# Altium schematic sheet Power_Management_2FMC_RTM.SchDoc: RFSoC_AMC
size 420 x 297 mm; Author: T. Przywozki; CompanyName: WUT ISE; DrawnBy: T. Przywozki; Organization: WUT ISE; Address1: PW ISE; Address2: Nowowiejska 15/19 00-665 Warsaw; Revision: 1.0; SheetNumber: 30; ModifiedBy: -; CheckedDate: -; Title2: 8 channel ADC & DAC; DivGrp: WUT ISE; Designer: T. Przywozki
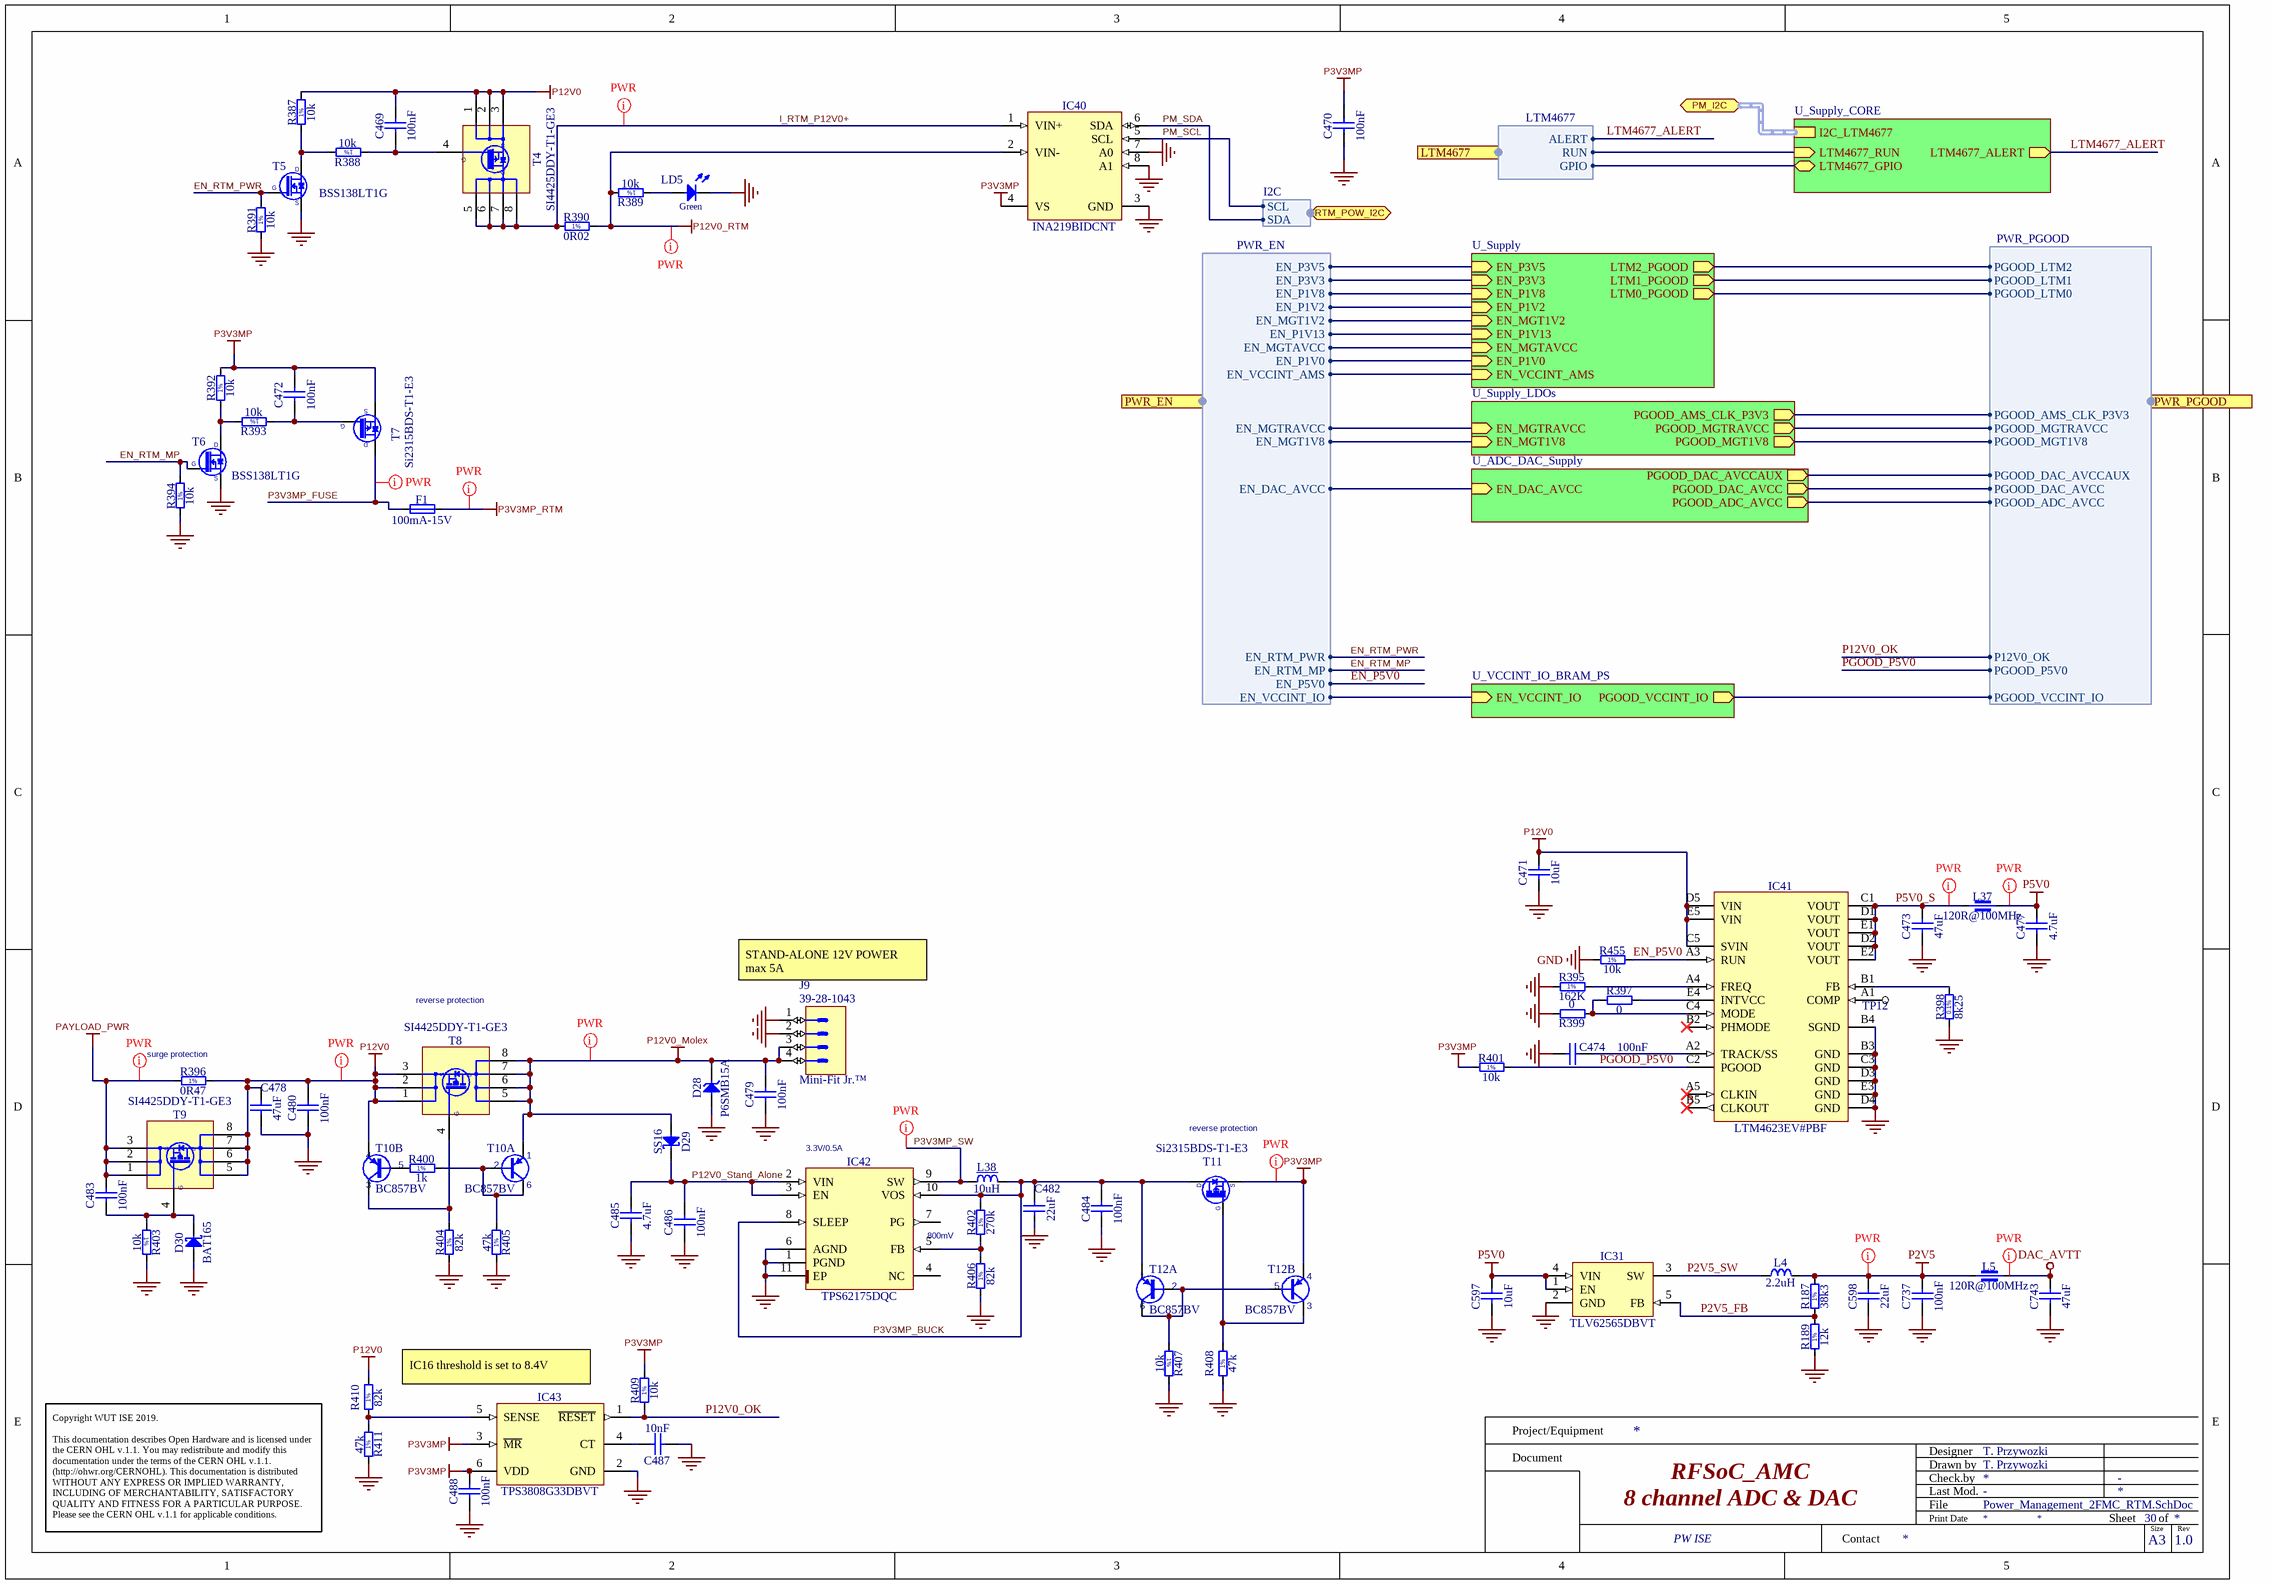
[diagram p0: Power_Management_2FMC_RTM.SchDoc]

## Parts
C469  100nF  [CAPC1005X55N]
C470  100nF  [CAPC1005X55N]
C471  10uF  [CAPC2012X95N]
C472  100nF  [CAPC1005X55N]
C473  47uF  [CAPC2012X140N]
C474  100nF  [CAPC1005X55N]
C477  4.7uF  [CAPC1709X95N]
C478  47uF  [CAPC3216X180N]
C479  100nF  [CAPC1005X55N]
C480  100nF  [CAPC1005X55N]
C482  22uF  [CAPC2012X135N]
C483  100nF  [CAPC1005X55N]
C484  100nF  [CAPC1005X55N]
C485  4.7uF  [CAPC1709X95N]
C486  100nF  [CAPC1005X55N]
C487  10nF  [CAPC1005X55N]
C488  100nF  [CAPC1005X55N]
C597  10uF  [CAPC2012X95N]
C598  22uF  [CAPC1709X100N]
C737  100nF  [CAPC0603X33N]
C743  47uF  [CAPC2012X140N]
D28  P6SMB15A  [DIOM5436X261N]
D29  SS16  [DIOM5127X229N]
D30  BAT165  [SOD2512X110N]
F1  100mA-15V  [FUSR_LITTELFUSE_0805L010]
IC31  TLV62565DBVT  [SOT95P280X145-5N]
IC40  INA219BIDCNT  [SOT65P280X145-8N]
IC41  LTM4623EV#PBF  [LGA25C127P5X5_625X625X192]
IC42  TPS62175DQC  [SON50P200X300X80-11N-R94X250]
IC43  TPS3808G33DBVT  [SOT95P280X145-6N]
J9  Mini-Fit Jr.™  Manufacturer Part Number: 39-28-1043  [MOLEX_39-28-1043]
L4  2.2uH  [IND_WURTH_WE-PMCI_0806LR]
L5  120R@100MHz  [INDC1608X95N]
L37  120R@100MHz  [INDC1608X95N]
L38  10uH  [IND_MURATA-PS_8400]
LD5  Green  [LED_KINGBRIGHT_KPH-1608CGCK]
R187  38k3  [RESC1005X40N]
R189  12k  [RESC1005X40N]
R387  10k  [RESC1005X40N]
R388  10k  [RESC1005X40N]
R389  10k  [RESC1005X40N]
R390  0R02  [RESC_VISHAY_WSL2512_0R007-0R5]
R391  10k  [RESC1005X40N]
R392  10k  [RESC1005X40N]
R393  10k  [RESC1005X40N]
R394  10k  [RESC1005X40N]
R395  162K  [RESC1608X55N]
R396  0R47  [RESC3216X65N]
R397  0  [RESC1005X40N]
R398  8k25  [RESC1608X55N]
R399  0  [RESC1005X40N]
R400  1k  [RESC1005X40N]
R401  10k  [RESC1005X40N]
R402  270k  [RESC1005X40N]
R403  10k  [RESC1005X40N]
R404  82k  [RESC1005X40N]
R405  47k  [RESC1005X40N]
R406  82k  [RESC1005X40N]
R407  10k  [RESC1005X40N]
R408  47k  [RESC1005X40N]
R409  10k  [RESC1005X40N]
R410  82k  [RESC1005X40N]
R411  47k  [RESC1005X40N]
R455  10k  [RESC1005X40N]
T4  SI4425DDY-T1-GE3  [SOIC127P600X175-8N]
T5  BSS138LT1G  [SOT95P240X110-3N]
T6  BSS138LT1G  [SOT95P240X110-3N]
T7  Si2315BDS-T1-E3  [SOT95P237X112-3N]
T8  SI4425DDY-T1-GE3  [SOIC127P600X175-8N]
T9  SI4425DDY-T1-GE3  [SOIC127P600X175-8N]
T10  BC857BV  [SOTFL50P160X60-6N]  (parts A,B of 2)
T11  Si2315BDS-T1-E3  [SOT95P237X112-3N]
T12  BC857BV  [SOTFL50P160X60-6N]  (parts A,B of 2)
TP12  TP  [TP]  (value not drawn)

## Sub-sheets
U_ADC_DAC_Supply = ADC_DAC_Supply.SchDoc: EN_DAC_AVCC (in), PGOOD_DAC_AVCC (out), PGOOD_ADC_AVCC (out), PGOOD_DAC_AVCCAUX (out)
U_Supply = Supply.SchDoc: EN_P3V3 (in), EN_P1V8 (in), EN_MGTAVCC (in), EN_P1V13 (in), EN_P1V2 (in), LTM2_PGOOD (out), EN_P1V0 (in), EN_P3V5 (in), LTM0_PGOOD (out), EN_VCCINT_AMS (in), EN_MGT1V2 (in), LTM1_PGOOD (out)
U_Supply_CORE = Supply_CORE.SchDoc: I2C_LTM4677 (harness I2C), LTM4677_GPIO (bidir), LTM4677_RUN (in), LTM4677_ALERT (out)
U_Supply_LDOs = Supply_LDOs.SchDoc: PGOOD_AMS_CLK_P3V3 (out), PGOOD_MGT1V8 (out), EN_MGT1V8 (in), EN_MGTRAVCC (in), PGOOD_MGTRAVCC (out)
U_VCCINT_IO_BRAM_PS = VCCINT_IO_BRAM_PS.SchDoc: EN_VCCINT_IO (in), PGOOD_VCCINT_IO (out)

## Ports
LTM4677 (harness LTM4677), PM_I2C (bidir, harness I2C), PWR_EN (harness PWR_EN), PWR_PGOOD (harness PWR_PGOOD), RTM_POW_I2C (bidir, harness I2C)

## Harnesses
I2C: SCL, SDA
PWR_EN: EN_MGTRAVCC, EN_MGT1V8, EN_DAC_AVCC, EN_P1V8, EN_P1V13, EN_MGT1V2, EN_P3V3, EN_P1V2, EN_P3V5, EN_MGTAVCC, EN_P1V0, EN_VCCINT_AMS, EN_RTM_PWR, EN_RTM_MP, EN_P5V0, EN_VCCINT_IO
PWR_PGOOD: PGOOD_AMS_CLK_P3V3, PGOOD_MGTRAVCC, PGOOD_MGT1V8, PGOOD_DAC_AVCCAUX, PGOOD_ADC_AVCC, PGOOD_DAC_AVCC, PGOOD_LTM0, PGOOD_LTM1, PGOOD_LTM2, P12V0_OK, PGOOD_P5V0, PGOOD_VCCINT_IO
LTM4677: GPIO, RUN, ALERT

## Nets
DAC_AVTT: C743.2 L5.2
GND: C470.1 C471.1 C473.1 C474.2 C477.1 C478.1 C479.1 C480.1 C482.1 C484.1 C485.1 C486.1 C487.1 C488.1 C597.1 C598.1 C737.1 C743.1 D28.2(A) D30.2(A) IC31.2(GND) IC40.3(GND) IC40.7(A0) IC40.8(A1) IC41.B3(GND) IC41.B4(SGND) IC41.C3(GND) IC41.D3(GND) IC41.D4(GND) IC41.E3(GND) IC42.1(PGND) IC42.6(AGND) IC42.11(EP) IC43.2(GND) J9.1 J9.2 LD5.1(C) R189.1 R391.1 R394.1 R395.1 R398.1 R399.2 R403.2 R404.1 R405.1 R406.1 R407.2 R408.1 R411.1 R455.1 T5.2(S) T6.2(S)
P2V5: C598.2 C737.2 L4.2 L5.1 R187.2
P3V3MP: C470.2 C472.2 C488.2 IC40.4(VS) IC43.3(~{MR}) IC43.6(VDD) R392.2 R401.1 R409.2 T7.2(S) T11.2(S) T12.4(E)
P3V3MP_RTM: F1.2
P5V0: C477.2 C597.2 IC31.1(EN) IC31.4(VIN) L37.2
P12V0: C469.2 C471.2 C478.2 C480.2 IC41.C5(SVIN) IC41.D5(VIN) IC41.E5(VIN) R387.2 R396.2 R410.2 T4.1(S) T4.2(S) T4.3(S) T8.1(S) T8.2(S) T8.3(S) T9.5(D) T9.6(D) T9.7(D) T9.8(D) T10.4(E)
P12V0_Molex: C479.2 D28.1(C) D29.2(A) J9.3 J9.4 T8.5(D) T8.6(D) T8.7(D) T8.8(D) T10.1(E)
P12V0_RTM: IC40.2(VIN-) R389.2 R390.2
PAYLOAD_PWR: C483.2 R396.1 T9.1(S) T9.2(S) T9.3(S)
EN_P5V0: IC41.A3(RUN) R455.2 ; port PWR_EN.EN_P5V0
EN_RTM_MP: R394.2 T6.1(G) ; port PWR_EN.EN_RTM_MP
EN_RTM_PWR: R391.2 T5.1(G) ; port PWR_EN.EN_RTM_PWR
I_RTM_P12V0+: IC40.1(VIN+) R390.1 T4.5(D) T4.6(D) T4.7(D) T4.8(D)
LTM4677_ALERT: sheet U_Supply_CORE/LTM4677_ALERT, port LTM4677.ALERT
P2V5_FB: IC31.5(FB) R187.1 R189.2
P2V5_SW: IC31.3(SW) L4.1
P3V3MP_BUCK: C482.2 C484.2 IC42.8(SLEEP) IC42.10(VOS) L38.2 R402.2 T11.3(D) T12.1(E)
P3V3MP_FUSE: F1.1 T7.3(D)
P3V3MP_SW: IC42.9(SW) L38.1
P5V0_S: C473.2 IC41.C1(VOUT) IC41.D1(VOUT) IC41.D2(VOUT) IC41.E1(VOUT) IC41.E2(VOUT) L37.1
P12V0_OK: IC43.1(~{RESET}) R409.1 ; port PWR_PGOOD.P12V0_OK
P12V0_Stand_Alone: C485.2 C486.2 D29.1(C) IC42.2(VIN) IC42.3(EN)
PGOOD_P5V0: IC41.C2(PGOOD) R401.2 ; port PWR_PGOOD.PGOOD_P5V0
PM_SCL: IC40.5(SCL) ; port RTM_POW_I2C.SCL
PM_SDA: IC40.6(SDA) ; port RTM_POW_I2C.SDA
NetC469_1: C469.1 R388.1 T4.4(S)
NetC472_1: C472.1 R393.1 T7.1(G)
NetC474_1: C474.1 IC41.A2(TRACK/SS)
NetC483_1: C483.1 D30.1(C) R403.1 T9.4(S)
NetC487_2: C487.2 IC43.4(CT)
NetIC41_A1: IC41.A1(COMP) TP12.1
NetIC41_A4: IC41.A4(FREQ) R395.2
NetIC41_B1: IC41.B1(FB) R398.2
NetIC41_C4: IC41.C4(MODE) R397.1 R399.1
NetIC41_E4: IC41.E4(INTVCC) R397.2
NetIC42_5: IC42.5(FB) R402.1 R406.2
NetIC43_5: IC43.5(SENSE) R410.1 R411.2
NetLD5_2: LD5.2(A) R389.1
NetR387_1: R387.1 R388.2 T5.3(D)
NetR392_1: R392.1 R393.2 T6.3(D)
NetR400_1: R400.1 T10.5(B)
NetR400_2: R400.2 R405.2 T10.2(B) T10.6(C)
NetR404_2: R404.2 T8.4(S) T10.3(C)
NetR407_1: R407.1 T12.2(B) T12.5(B) T12.6(C)
NetR408_2: R408.2 T11.1(G) T12.3(C)
(unnamed): sheet U_ADC_DAC_Supply/EN_DAC_AVCC, port PWR_EN.EN_DAC_AVCC
(unnamed): sheet U_ADC_DAC_Supply/PGOOD_DAC_AVCC, port PWR_PGOOD.PGOOD_DAC_AVCC
(unnamed): sheet U_ADC_DAC_Supply/PGOOD_ADC_AVCC, port PWR_PGOOD.PGOOD_ADC_AVCC
(unnamed): sheet U_ADC_DAC_Supply/PGOOD_DAC_AVCCAUX, port PWR_PGOOD.PGOOD_DAC_AVCCAUX
(unnamed): sheet U_Supply_CORE/LTM4677_GPIO, port LTM4677.GPIO
(unnamed): sheet U_Supply_CORE/LTM4677_RUN, port LTM4677.RUN
(unnamed): sheet U_Supply_LDOs/PGOOD_AMS_CLK_P3V3, port PWR_PGOOD.PGOOD_AMS_CLK_P3V3
(unnamed): sheet U_Supply_LDOs/PGOOD_MGT1V8, port PWR_PGOOD.PGOOD_MGT1V8
(unnamed): sheet U_Supply_LDOs/EN_MGT1V8, port PWR_EN.EN_MGT1V8
(unnamed): sheet U_Supply_LDOs/EN_MGTRAVCC, port PWR_EN.EN_MGTRAVCC
(unnamed): sheet U_Supply_LDOs/PGOOD_MGTRAVCC, port PWR_PGOOD.PGOOD_MGTRAVCC
(unnamed): sheet U_Supply/EN_P3V3, port PWR_EN.EN_P3V3
(unnamed): sheet U_Supply/EN_P1V8, port PWR_EN.EN_P1V8
(unnamed): sheet U_Supply/EN_MGTAVCC, port PWR_EN.EN_MGTAVCC
(unnamed): sheet U_Supply/EN_P1V13, port PWR_EN.EN_P1V13
(unnamed): sheet U_Supply/EN_P1V2, port PWR_EN.EN_P1V2
(unnamed): sheet U_Supply/LTM2_PGOOD, port PWR_PGOOD.PGOOD_LTM2
(unnamed): sheet U_Supply/EN_P1V0, port PWR_EN.EN_P1V0
(unnamed): sheet U_Supply/EN_P3V5, port PWR_EN.EN_P3V5
(unnamed): sheet U_Supply/LTM0_PGOOD, port PWR_PGOOD.PGOOD_LTM0
(unnamed): sheet U_Supply/EN_VCCINT_AMS, port PWR_EN.EN_VCCINT_AMS
(unnamed): sheet U_Supply/EN_MGT1V2, port PWR_EN.EN_MGT1V2
(unnamed): sheet U_Supply/LTM1_PGOOD, port PWR_PGOOD.PGOOD_LTM1
(unnamed): sheet U_VCCINT_IO_BRAM_PS/EN_VCCINT_IO, port PWR_EN.EN_VCCINT_IO
(unnamed): sheet U_VCCINT_IO_BRAM_PS/PGOOD_VCCINT_IO, port PWR_PGOOD.PGOOD_VCCINT_IO

Not connected (* = marked no-connect by the designer): IC41 A5(CLKIN)* B2(PHMODE)* B5(CLKOUT)*; IC42 4(NC) 7(PG)

## Buses and harness runs
harness port PM_I2C = sheet U_Supply_CORE/I2C_LTM4677

## Layout directives
net class PWR: DAC_AVTT, I_RTM_P12V0+, P2V5, P3V3MP, P3V3MP_FUSE, P3V3MP_RTM, P3V3MP_SW, P5V0, P5V0_S, P12V0, P12V0_Molex, P12V0_RTM, PAYLOAD_PWR

## Notes on the sheet
- (near J9) STAND-ALONE 12V POWER
  max 5A
- (near R396) surge protection
- reverse protection
- (near T11) reverse protection
- (near IC42) 3.3V/0.5A
- (near IC42) 800mV
- IC16 threshold is set to 8.4V
- Project/Equipment
- Document
- Designer
- Drawn by
- Check.by
- Copyright WUT ISE 2019.
  This documentation describes Open Hardware and is licensed under the CERN OHL v.1.1. You may redistribute and modify this documentation under the terms of the CERN OHL v.1.1. (http://ohwr.org/CERNOHL). This documentation is distributed WITHOUT ANY EXPRESS OR IMPLIED WARRANTY, INCLUDING OF MERCHANTABILITY, SATISFACTORY QUALITY AND FITNESS FOR A PARTICULAR PURPOSE. Please see the CERN OHL v.1.1 for applicable conditions.
- Contact
- File
- Last Mod.
- Print Date
- Sheet
- Size
- A3
- of
- Rev
- (in symbol R0402_1K_1%_0.0625W_100PPM) 1%
- (in symbol R0402_10K_1%_0.0625W_100PPM) 1%
- (in symbol R0402_12K_1%_0.0625W_100PPM) 1%
- (in symbol R0402_38K3_1%_0.0625W_100PPM) 1%
- (in symbol R0402_47K_1%_0.0625W_100PPM) 1%
- (in symbol R0402_82K_1%_0.0625W_100PPM) 1%
- (in symbol R0402_270K_1%_0.0625W_100PPM) 1%
- (in symbol R0603_8K25_0.1%_0.063W_10PPM) 0.1%
- (in symbol R0603_162K_1%_0.1W_100PPM) 1%
- (in symbol R1206_0R47_1%_0.5W_600PPM) 1%
- (in symbol R2512_0R02_1%_1W_75PPM_VISHAY_WSL) 1%
- (in symbol SI4425DDY-T1-GE3) G

## Library data of the parts
C469 C470 C472 C479 C480 C483 C484 C486 C488 = CC0402_100NF_16V_10%_X5R: Non-polarised capacitor; Manufacturer: GENERIC; Part Description: SMD Multilayer Chip Ceramic Capacitor; Manufacturer1 Part Number: GRM155R61C104KA88D; Tolerance: ±10%; Voltage: 16V; TC: X5R; Manufacturer Part Number: CC0402_100NF_16V_10%_X5R; Part Number: CC0402_100NF_16V_10%_X5R; Value: 100nF; Component Kind: Standard; Component Type: Standard; Pin Count: 2; Status: None; Case: 0402; Mounted: Yes; Socket: No; SMD: Yes; Sense: No; Manufacturer1 Example: MURATA; Manufacturer1 ComponentHeight: 0.55mm; HelpURL: \\cern.ch\dfs\Applications\Altium\Datasheets\CC0402_X5R_MURATA_GRM.pdf; Author: CERN DEM JLC; CreateDate: 10.12.2013; LatestRevisionDate: 10.12.2013
C471 C597 = CC0805_10UF_25V_10%_X5R: Non-polarised capacitor; Part Description: SMD Multilayer Chip Ceramic Capacitor; Manufacturer: GENERIC; Manufacturer1 Part Number: GRM219R61E106KA12D; Voltage: 25V; TC: X5R; Tolerance: ±10%; Part Number: CC0805_10UF_25V_10%_X5R; Component Kind: Standard; Component Type: Standard; Pin Count: 2; Value: 10uF; Status: Preferred; Manufacturer Part Number: CC0805_10UF_25V_10%_X5R; Case: 0805; Mounted: Yes; Socket: No; SMD: Yes; Sense: No; Manufacturer1 Example: MURATA; Manufacturer1 ComponentHeight: 0.95mm; HelpURL: \\cern.ch\dfs\Applications\Altium\Datasheets\CC0805_X5R_MURATA_GRM.pdf; Author: CERN DEM JLC; CreateDate: 25.10.2012; LatestRevisionDate: 06.09.2016
C473 C743 = CC0805_47UF_6.3V_20%_X5R: Non-polarised capacitor; Manufacturer: GENERIC; Part Description: SMD Multilayer Chip Ceramic Capacitor; Manufacturer1 Part Number: C0805C476M9PACTU; Tolerance: ±20%; Voltage: 6.3V; TC: X5R; Manufacturer Part Number: CC0805_47UF_6.3V_20%_X5R; Part Number: CC0805_47UF_6.3V_20%_X5R; Value: 47uF; Component Kind: Standard; Component Type: Standard; Pin Count: 2; Status: Preferred; Case: 0805; Mounted: Yes; Socket: No; SMD: Yes; Sense: No; Manufacturer1 Example: KEMET; Manufacturer1 ComponentHeight: 1.4mm; HelpURL: \\cern.ch\dfs\Applications\Altium\Datasheets\CC0805_X5R_KEMET.pdf; Author: CERN DEM JLC; CreateDate: 16.10.2012; LatestRevisionDate: 16.10.2012
C474 = CC0402_100NF_16V_10%_X5R: Non-polarised capacitor; Part Description: SMD Multilayer Chip Ceramic Capacitor; Manufacturer: GENERIC; Manufacturer1 Part Number: GRM155R61C104KA88D; Voltage: 16V; TC: X5R; Tolerance: ±10%; Part Number: CC0402_100NF_16V_10%_X5R; Component Kind: Standard; Component Type: Standard; Pin Count: 2; Value: 100nF; Status: None; Manufacturer Part Number: CC0402_100NF_16V_10%_X5R; Case: 0402; Mounted: Yes; Socket: No; SMD: Yes; Sense: No; Manufacturer1 Example: MURATA; Manufacturer1 ComponentHeight: 0.55mm; HelpURL: \\cern.ch\dfs\Applications\Altium\Datasheets\CC0402_X5R_MURATA_GRM.pdf; Author: CERN DEM JLC; CreateDate: 10.12.2013; LatestRevisionDate: 10.12.2013
C477 C485 = CC0603_4.7UF_16V_10%_X5R: Non-polarised capacitor; Manufacturer: GENERIC; Part Description: SMD Multilayer Chip Ceramic Capacitor; Manufacturer1 Part Number: EMK107ABJ475KA-T; Tolerance: ±10%; Voltage: 16V; TC: X5R; Manufacturer Part Number: CC0603_4.7UF_16V_10%_X5R; Part Number: CC0603_4.7UF_16V_10%_X5R; Value: 4.7uF; Component Kind: Standard; Component Type: Standard; Pin Count: 2; Status: None; Case: 0603; Mounted: Yes; Socket: No; SMD: Yes; Sense: No; Manufacturer1 Example: TAIYO YUDEN; Manufacturer1 ComponentHeight: 0.95mm; HelpURL: \\cern.ch\dfs\Applications\Altium\Datasheets\CC0603_X7R_TAIYO-YUDEN_HIGH-VALUE.pdf; Author: CERN DEM JLC; CreateDate: 16.12.2013; LatestRevisionDate: 16.09.2014
C478 = CC1206_47UF_25V_20%_X5R: Non-polarised capacitor; Manufacturer: GENERIC; Part Description: SMD Multilayer Chip Ceramic Capacitor; Manufacturer1 Part Number: C3216X5R1E476M160AC; Tolerance: ±20%; Voltage: 25V; TC: X5R; Manufacturer Part Number: CC1206_47UF_25V_20%_X5R; Part Number: CC1206_47UF_25V_20%_X5R; Value: 47uF; Component Kind: Standard; Component Type: Standard; Pin Count: 2; Status: None; Case: 1206; Mounted: Yes; Socket: No; SMD: Yes; Sense: No; Manufacturer1 Example: TDK; Manufacturer1 ComponentHeight: 1.8mm; HelpURL: \\cern.ch\dfs\Applications\Altium\Datasheets\CC1206_X5R_TDK_C.pdf; Author: CERN DEM JLC; CreateDate: 20.11.2013; LatestRevisionDate: 14.03.2017
C482 = CC0805_22UF_16V_10%_X5R: Non-polarised capacitor; Manufacturer: GENERIC; Part Description: SMD Multilayer Chip Ceramic Capacitor; Manufacturer1 Part Number: C2012X5R1C226KT; Tolerance: ±10%; Voltage: 16V; TC: X5R; Manufacturer Part Number: CC0805_22UF_16V_10%_X5R; Part Number: CC0805_22UF_16V_10%_X5R; Value: 22uF; Component Kind: Standard; Component Type: Standard; Pin Count: 2; Status: Preferred; Case: 0805; Mounted: Yes; Socket: No; SMD: Yes; Sense: No; Manufacturer1 Example: TDK; Manufacturer1 ComponentHeight: 1.35mm; HelpURL: \\cern.ch\dfs\Applications\Altium\Datasheets\CC0805_X5R_TDK_C.pdf; Author: CERN DEM JLC; CreateDate: 25.10.2012; LatestRevisionDate: 25.10.2012
C487 = CC0402_10NF_16V_10%_X7R: Non-polarised capacitor; Manufacturer: GENERIC; Part Description: SMD Multilayer Chip Ceramic Capacitor; Manufacturer1 Part Number: 223878715636; Tolerance: ±10%; Voltage: 16V; TC: X7R; Manufacturer Part Number: CC0402_10NF_16V_10%_X7R; Part Number: CC0402_10NF_16V_10%_X7R; Value: 10nF; Component Kind: Standard; Component Type: Standard; Pin Count: 2; Status: Not Recommended; Case: 0402; Mounted: Yes; Socket: No; SMD: Yes; Sense: No; Manufacturer1 Example: PHYCOMP; Manufacturer1 ComponentHeight: 0.55mm; HelpURL: \\cern.ch\dfs\Applications\Altium\Datasheets\CC0402_X7R_PHYCOMP.pdf; Author: CERN DEM JLC; CreateDate: 03.12.2007; LatestRevisionDate: 03.12.2007
C598 = CC0603_22UF_6.3V_20%_X5R: Non-polarised capacitor; Part Description: SMD Multilayer Chip Ceramic Capacitor; Manufacturer: GENERIC; Manufacturer1 Part Number: C1608X5R0J226M080AC; Voltage: 6.3V; TC: X5R; Tolerance: ±20%; Part Number: CC0603_22UF_6.3V_20%_X5R; Component Kind: Standard; Component Type: Standard; Pin Count: 2; Value: 22uF; Status: None; Manufacturer Part Number: CC0603_22UF_6.3V_20%_X5R; Case: 0603; Mounted: Yes; Socket: No; SMD: Yes; Sense: No; Manufacturer1 Example: TDK; Manufacturer1 ComponentHeight: 1mm; HelpURL: \\cern.ch\dfs\Applications\Altium\Datasheets\CC0603_X5R_TDK_C.pdf; Author: CERN DEM JLC; CreateDate: 16.12.2013; LatestRevisionDate: 13.09.2016
C737 = CC0201_100NF_6.3V_10%_X5R: Non-polarised capacitor; Part Description: SMD Multilayer Chip Ceramic Capacitor; Manufacturer: GENERIC; Manufacturer1 Part Number: 02016D104KAT2A; Voltage: 6.3V; TC: X5R; Tolerance: ±10%; Part Number: CC0201_100NF_6.3V_10%_X5R; Component Kind: Standard; Component Type: Standard; Pin Count: 2; Value: 100nF; Status: Not Recommended; Manufacturer Part Number: CC0201_100NF_6.3V_10%_X5R; Case: 0201; Mounted: Yes; Socket: No; SMD: Yes; Sense: No; Manufacturer1 Example: AVX; Manufacturer1 ComponentHeight: 0.33mm; HelpURL: \\cern.ch\dfs\Applications\Altium\Datasheets\CC0201_X5R_AVX.pdf; Author: CERN DEM JLC; CreateDate: 03.12.2007; LatestRevisionDate: 03.12.2007
D28 = P6SMB15A: Transient Voltage Suppressor Diode (Uni-Directional); Manufacturer: LITTELFUSE; Part Description: Uni-directional Transient Voltage Suppressor (TVS) Diode; Voltage: 15V; Power: 600W; PressFit: No; Bonding: No; Manufacturer Part Number: P6SMB15A; PackageDescription: DO-214-AA/SMB Diode, Molded Body; 5.40mm L X 3.62mm W X 2.61mm H, IPC Medium Density; Part Number: P6SMB15A; Component Kind: Standard; Component Type: Standard; Device: P6SMB15A; Pin Count: 2; Case: SMB; Mounted: Yes; Socket: No; SMD: Yes; Sense: No; ComponentHeight: 2.61mm; HelpURL: \\cern.ch\dfs\Applications\Altium\Datasheets\P6SMB15A.pdf; Author: CERN DEM JLC; CreateDate: 12.07.2017; LatestRevisionDate: 12.07.2017
D29 = SS16: Schottky Diode; Manufacturer: VISHAY GENERAL SEMICONDUCTOR; Part Description: Surface Mount Schottky Barrier Rectifier; Voltage: 60V; Power: 1A; PressFit: No; Bonding: No; Manufacturer Part Number: SS16; PackageDescription: DO-214-AC Molded Diode, Body 5.1x2.7mm, IPC Medium Density; Part Number: SS16; Component Kind: Standard; Component Type: Standard; Device: SS16; Pin Count: 2; Case: DO-214AC; Mounted: Yes; Socket: No; SMD: Yes; Sense: No; ComponentHeight: 2.29mm; HelpURL: \\cern.ch\dfs\Applications\Altium\Datasheets\SS16.pdf; Author: CERN DEM JLC; CreateDate: 15.07.2008; LatestRevisionDate: 23.08.2010
D30 = BAT165: Schottky Diode; Manufacturer: INFINEON; Part Description: Medium Power AF Schottky Diode; Voltage: 40V; Power: 750mA; PressFit: No; Bonding: No; Manufacturer Part Number: BAT165; PackageDescription: Small Outline Diode (SOD-323), 1.70mm W X 1.25mm L X 1.10mm H body,  IPC Medium Density; Part Number: BAT165; Component Kind: Standard; Component Type: Standard; Device: BAT165; Pin Count: 2; Case: SOD323; Mounted: Yes; Socket: No; SMD: Yes; Sense: No; ComponentHeight: 1.1mm; HelpURL: \\cern.ch\dfs\Applications\Altium\Datasheets\BAT165.pdf; Author: CERN DEM JLC; CreateDate: 12.11.2014; LatestRevisionDate: 12.11.2014
F1 = FUSR_LITTELFUSE_0805L010YR: Fuse; Part Description: POLYFUSE® Surface Mount Resettable PTC; PressFit: No; Manufacturer Part Number: 0805L010YR; Manufacturer: LITTELFUSE; PackageDescription: Surface Mount POLY-FUSE® Resettable PTC, 0805L Series; Part Number: FUSR_LITTELFUSE_0805L010YR; Value: 100mA-15V; Component Kind: Standard; Component Type: Standard; Pin Count: 2; Family: Fuses Resettable; Mounted: Yes; Socket: No; SMD: Yes; Sense: No; ComponentHeight: 1mm; HelpURL: \\cern.ch\dfs\Applications\Altium\Datasheets\FUSR_LITTELFUSE_0805L010YR.pdf; Author: CERN DEM JLC; CreateDate: 11.09.2012; LatestRevisionDate: 11.09.2012
IC31 = TLV62565DBVT: 1.5A High Efficiency Step-Down Converter, Adjustable Output Voltage; Manufacturer: TEXAS INSTRUMENTS; PressFit: No; Bonding: No; Part Number: TLV62565DBVT; Component Kind: Standard; Component Type: Standard; Device: TLV62565DBVT; PackageDescription: SOT, 0.95mm Pitch; 5 Pin, 1.60mm W X 2.90mm L X 1.45mm H Body, IPC Medium Density; Part Description: 1.5A High Efficiency Step-Down Converter, Adjustable Output Voltage; Manufacturer Part Number: TLV62565DBVT; Pin Count: 5; Case: SOT23-5; Mounted: Yes; Socket: No; SMD: Yes; Sense: No; ComponentHeight: 1.45mm; HelpURL: \\cern.ch\dfs\Applications\Altium\Datasheets\TLV62565DBVT.pdf; Author: CERN DEM JMW; CreateDate: 29.08.2016; LatestRevisionDate: 29.08.2016
IC40 = INA219BIDCNT: Zero-Drift, Bi-Directional CURRENT/POWER MONITOR with I2C™ Interface; Manufacturer: TEXAS INSTRUMENTS; PressFit: No; Bonding: No; Manufacturer Part Number: INA219BIDCNT; PackageDescription: SOT, 0.65mm pitch; 8 pin, 1.625mm W X 2.90mm L X 1.45mm H body, IPC Medium Density; Part Description: Zero-Drift, Bi-Directional CURRENT/POWER MONITOR with I2C™ Interface; Part Number: INA219BIDCNT; Component Kind: Standard; Component Type: Standard; Device: INA219BIDCNT; Pin Count: 8; Case: SOT23-8; Mounted: Yes; Socket: No; SMD: Yes; Sense: No; ComponentHeight: 1.45mm; Author: CERN DEM JLC; HelpURL: \\cern.ch\dfs\Applications\Altium\Datasheets\INA219BIDCNT.pdf; CreateDate: 24.09.2013; LatestRevisionDate: 24.09.2013
IC41 = LTM4623EV#PBF: 4V-20V to 0.6V-5.5V, Iout 3A Step-Down DC/DC uModule Regulator; Manufacturer: LINEAR TECHNOLOGY; PressFit: No; Bonding: No; Part Number: LTM4623EV#PBF; Component Kind: Standard; Component Type: Standard; Device: LTM4623EV#PBF; PackageDescription: LGA, 1.27mm Pitch, Square; 25 Pin, 5 Columns X 5 Rows, 6.25mm X 6.25mm X 1.92mm H; Part Description: 4V-20V to 0.6V-5.5V, Iout 3A Step-Down DC/DC uModule Regulator; Manufacturer Part Number: LTM4623EV#PBF; Pin Count: 25; Case: LGA25; Mounted: Yes; Socket: No; SMD: Yes; Sense: No; ComponentHeight: 1.92mm; HelpURL: \\cern.ch\dfs\Applications\Altium\Datasheets\LTM4623EV#PBF.pdf; Author: CERN DEM JMW; CreateDate: 23.09.2015; LatestRevisionDate: 23.09.2015
IC42 = TPS62175DQC: 4.75-28VDC to 1-6VDC, 500mA Step-Down Converter With Sleep Mode; Manufacturer: TEXAS INSTRUMENTS; PressFit: No; Bonding: No; Manufacturer Part Number: TPS62175DQC; PackageDescription: SON, 10-Leads, Body 2x3mm, Pitch 0.5mm, Thermal Pad 0.94x2.5mm, IPC Medium Density; Part Description: 4.75-28VDC to 1-6VDC, 500mA Step-Down Converter With Sleep Mode; Part Number: TPS62175DQC; Component Kind: Standard; Component Type: Standard; Device: TPS62175DQC; Pin Count: 11; Case: SON10; Mounted: Yes; Socket: No; SMD: Yes; Sense: No; ComponentHeight: 0.8mm; HelpURL: \\cern.ch\dfs\Applications\Altium\Datasheets\TPS62175DQC.pdf; Author: CERN DEM JMW; CreateDate: 11.08.2015; LatestRevisionDate: 11.08.2015
IC43 = TPS3808G33DBVT: Low Quiescent Current, Programmable-Delay Supervisory Circuit; Manufacturer: TEXAS INSTRUMENTS; Part Description: 3.3V, Low Quiescent Current, Programmable-Delay Supervisory Circuit; PressFit: No; Bonding: No; Manufacturer Part Number: TPS3808G33DBVT; PackageDescription: SOT23, 6-Leads, Body 1.6x3.0mm, Pitch 0.95mm, IPC Medium Density; Part Number: TPS3808G33DBVT; Component Kind: Standard; Component Type: Standard; Device: TPS3808G33DBVT; Pin Count: 6; Case: SOT23-6; Mounted: Yes; Socket: No; SMD: Yes; Sense: No; ComponentHeight: 1.45mm; Author: CERN DEM JLC; HelpURL: \\cern.ch\dfs\Applications\Altium\Datasheets\TPS3808G33DBVT.pdf; CreateDate: 05.11.2013; LatestRevisionDate: 05.11.2013
J9 = MOLEX_39-28-1043: Connector 4 Male; Manufacturer: MOLEX; Part Description: 4.20mm (.165") Pitch Mini-Fit Jr.™ Header, Dual Row, Vertical, without Snap-in Plastic Peg PCB Lock, 4 Circuits; PressFit: No; Part Number: MOLEX_39-28-1043; Component Kind: Standard; Component Type: Standard; Pin Count: 4; Family: Mini-Fit Jr.™; Mounted: Yes; Socket: No; SMD: No; Sense: No; Status: None; ComponentHeight: 13.1mm; HelpURL: \\cern.ch\dfs\Applications\Altium\Datasheets\MOLEX_39-28-1043.pdf; Author: CERN DEM JLC; CreateDate: 12.03.2009; LatestRevisionDate: 06.03.2012
L4 = IND_2.2UH_20%_WURTH_WE-PMCI_74479276222C: Inductor; Part Description: SMD Power Molded Chip  Inductor (WE-PMCI Series); Manufacturer: WURTH ELEKTRONIK; Power: 1.1A; Resistance: 0.112R; Tolerance: ±20%; Part Number: IND_2.2UH_20%_WURTH_WE-PMCI_74479276222C; Component Kind: Standard; Component Type: Standard; Pin Count: 2; Value: 2.2uH; Status: None; Manufacturer Part Number: 74479276222C; Case: 0806; Mounted: Yes; Socket: No; SMD: Yes; Sense: No; ComponentHeight: 1mm; HelpURL: \\cern.ch\dfs\Applications\Altium\Datasheets\IND_WURTH_WE-PMCI_74479276222C.pdf; Author: CERN DEM JLC; CreateDate: 20.10.2016; LatestRevisionDate: 20.10.2016
L5 L37 = IND0603_MURATA_BLM18PG121SN1D: Manufacturer: MURATA; Part Description: SMD EMIFIL Chip Ferrite Bead; Power: 2A; Resistance: 0.05R; Case: 0603; ComponentHeight: 0.95mm; Manufacturer Part Number: BLM18PG121SN1D; Part Number: IND0603_MURATA_BLM18PG121SN1D; Pin Count: 2; SMD: Yes; Value: 120R@100MHz; Component Kind: Standard; Component Type: Standard; Status: None; Mounted: Yes; Socket: No; Sense: No; HelpURL: \\cern.ch\dfs\Applications\Altium\Datasheets\IND0603_MURATA_BLM18P.pdf; Author: CERN DEM BC; CreateDate: 27.07.2015; LatestRevisionDate: 25.10.2018
L38 = IND_10UH_10%_MURATA-PS_8400: Inductor With Core; Manufacturer Part Number: 84103C; Manufacturer: MURATA POWER SOLUTIONS; Part Description: Miniature Surface Mount Power Inductor (8400 Series); Tolerance: ±10%; Power: 950mA; Resistance: 0.24R; Part Number: IND_10UH_10%_MURATA-PS_8400; Value: 10uH; Component Kind: Standard; Component Type: Standard; Pin Count: 2; Status: None; Mounted: Yes; Socket: No; SMD: Yes; Sense: No; ComponentHeight: 2.9mm; HelpURL: \\cern.ch\dfs\Applications\Altium\Datasheets\IND_MURATA-PS_8400.pdf; Author: CERN DEM JLC; CreateDate: 02.07.2012; LatestRevisionDate: 02.07.2012
LD5 = LED_KINGBRIGHT_KPH-1608CGCK: LED Green 1C 2A; Part Description: SMD Green LED, Case 1.6mmX0.8mm(0603), 0.65mm Thickness; PressFit: No; Bonding: No; Manufacturer Part Number: KPH-1608CGCK; Manufacturer: KINGBRIGHT; PackageDescription: SMT Green LED, Case 0603, Body L 1.6 x W 0.8mm H 0.65mm; Part Number: LED_KINGBRIGHT_KPH-1608CGCK; Component Kind: Standard; Component Type: Standard; Color: Green; Pin Count: 2; Mounted: Yes; Socket: No; SMD: Yes; Sense: No; ComponentHeight: 0.65mm; HelpURL: \\cern.ch\dfs\Applications\Altium\Datasheets\LED_KINGBRIGHT_KPH-1608CGCK.pdf; Author: CERN DEM JLC; CreateDate: 03.07.2017; LatestRevisionDate: 03.07.2017
R187 = R0402_38K3_1%_0.0625W_100PPM: Resistor - 1%; Part Description: General Purpose Thick Film Chip Resistor; Manufacturer: GENERIC; Manufacturer1 Part Number: 232270673833L or RC0402FR-0738K3L; TC: ±100ppm/°C; PressFit: No; Part Number: R0402_38K3_1%_0.0625W_100PPM; Component Kind: Standard; Component Type: Standard; Pin Count: 2; Value: 38k3; Status: Not Recommended; Power: 0.0625W; Tolerance: ±1%; Manufacturer Part Number: R0402_38K3_1%_0.0625W_100PPM; Case: 0402; Mounted: Yes; Sense: No; Socket: No; SMD: Yes; Manufacturer1 Example: YAGEO PHYCOMP; Manufacturer1 ComponentHeight: 0.4mm; HelpURL: \\cern.ch\dfs\Applications\Altium\Datasheets\R0402_Phycomp_RC0402.pdf; Author: CERN DEM BC; CreateDate: 29.07.2015; LatestRevisionDate: 29.07.2015
R189 = R0402_12K_1%_0.0625W_100PPM: Resistor - 1%; Part Description: General Purpose Thick Film Chip Resistor; Manufacturer: GENERIC; Manufacturer1 Part Number: 232270671203L; TC: ±100ppm/°C; PressFit: No; Part Number: R0402_12K_1%_0.0625W_100PPM; Component Kind: Standard; Component Type: Standard; Pin Count: 2; Value: 12k; Status: Not Recommended; Power: 0.0625W; Tolerance: ±1%; Manufacturer Part Number: R0402_12K_1%_0.0625W_100PPM; Case: 0402; Mounted: Yes; Sense: No; Socket: No; SMD: Yes; Manufacturer1 Example: YAGEO PHYCOMP; Manufacturer1 ComponentHeight: 0.4mm; HelpURL: \\cern.ch\dfs\Applications\Altium\Datasheets\R0402_Phycomp_RC0402.pdf; Author: CERN DEM JLC; CreateDate: 03.12.2007; LatestRevisionDate: 17.10.2012
R387-R389 R391-R394 R401 R403 R407 R409 R455 = R0402_10K_1%_0.0625W_100PPM: Resistor - 1%; Manufacturer: GENERIC; Part Description: General Purpose Thick Film Chip Resistor; Manufacturer1 Part Number: 232270671003L; TC: ±100ppm/°C; PressFit: No; Manufacturer Part Number: R0402_10K_1%_0.0625W_100PPM; Part Number: R0402_10K_1%_0.0625W_100PPM; Tolerance: ±1%; Value: 10k; Component Kind: Standard; Component Type: Standard; Pin Count: 2; Status: Not Recommended; Power: 0.0625W; Case: 0402; Mounted: Yes; Sense: No; Socket: No; SMD: Yes; Manufacturer1 Example: YAGEO PHYCOMP; Manufacturer1 ComponentHeight: 0.4mm; HelpURL: \\cern.ch\dfs\Applications\Altium\Datasheets\R0402_Phycomp_RC0402.pdf; Author: CERN DEM JLC; CreateDate: 03.12.2007; LatestRevisionDate: 17.10.2012
R390 = R2512_0R02_1%_1W_75PPM_VISHAY_WSL: Resistor - 1%; Manufacturer Part Number: WSL2512R0200FEA; Manufacturer: VISHAY DALE; Part Description: Power Metal Strip® Resistor; Power: 1W; TC: ±75ppm/°C; PressFit: No; Part Number: R2512_0R02_1%_1W_75PPM_VISHAY_WSL; Tolerance: ±1%; Value: 0R02; Component Kind: Standard; Component Type: Standard; Pin Count: 2; Status: None; Case: 2512; Mounted: Yes; Sense: No; Socket: No; SMD: Yes; ComponentHeight: 0.89mm; HelpURL: \\cern.ch\dfs\Applications\Altium\Datasheets\R2512_VISHAY_WSL.pdf; Author: CERN DEM JLC; CreateDate: 17.11.2011; LatestRevisionDate: 23.10.2017
R395 = R0603_162K_1%_0.1W_100PPM: Resistor - 1%; Part Description: General Purpose Thick Film Chip Resistor; Manufacturer: GENERIC; Manufacturer1 Part Number: CRCW0603162KFKEA; Power: 0.1W; TC: ±100ppm/°C; PressFit: No; Part Number: R0603_162K_1%_0.1W_100PPM; Component Kind: Standard; Component Type: Standard; Pin Count: 2; Value: 162K; Status: Preferred; Tolerance: ±1%; Manufacturer Part Number: R0603_162K_1%_0.1W_100PPM; Case: 0603; Mounted: Yes; Sense: No; Socket: No; SMD: Yes; Manufacturer1 Example: VISHAY; Manufacturer1 ComponentHeight: 0.55mm; HelpURL: \\cern.ch\dfs\Applications\Altium\Datasheets\R0603_VISHAY_CRCW e3.pdf; Author: CERN DEM BC; CreateDate: 10.01.2020; LatestRevisionDate: 10.01.2020
R396 = R1206_0R47_1%_0.5W_600PPM: Resistor - 1%; Manufacturer Part Number: RL1206FR-7W0R47  (35051914707); Manufacturer: YAGEO PHYCOMP; Part Description: Low Ohmique High Power Chip Resistor; Power: 0.5W; TC: ±600ppm/°C; PressFit: No; Part Number: R1206_0R47_1%_0.5W_600PPM; Tolerance: ±1%; Value: 0R47; Component Kind: Standard; Component Type: Standard; Pin Count: 2; Status: Not Recommended; Case: 1206; Mounted: Yes; Sense: No; Socket: No; SMD: Yes; ComponentHeight: 0.65mm; HelpURL: \\cern.ch\dfs\Applications\Altium\Datasheets\R1206_PHYCOMP_LRC02P.pdf; Author: CERN DEM JLC; CreateDate: 22.04.2010; LatestRevisionDate: 22.04.2010
R397 R399 = R0402_0R_JUMPER: Resistor; Manufacturer: GENERIC; Part Description: 1A (0.05R Max DC Resistance) Zero Ohm Jumper; Manufacturer1 Part Number: 232270591001L; PressFit: No; Manufacturer Part Number: R0402_0R_JUMPER; Part Number: R0402_0R_JUMPER; Value: 0; Component Kind: Standard; Component Type: Standard; Pin Count: 2; Status: Not Recommended; Case: 0402; Mounted: Yes; Sense: No; Socket: No; SMD: Yes; Manufacturer1 Example: YAGEO PHYCOMP; Manufacturer1 ComponentHeight: 0.4mm; HelpURL: \\cern.ch\dfs\Applications\Altium\Datasheets\R0402_Phycomp_RC0402.pdf; Author: CERN DEM JLC; CreateDate: 03.12.2007; LatestRevisionDate: 17.10.2012
R398 = R0603_8K25_0.1%_0.063W_10PPM: Resistor - 0.1%; Part Description: Thin Film Chip Resistor; Manufacturer: GENERIC; Manufacturer1 Part Number: RN73C1J8K25BTDF; Power: 0.063W; TC: ±10ppm; PressFit: No; Part Number: R0603_8K25_0.1%_0.063W_10PPM; Component Kind: Standard; Component Type: Standard; Pin Count: 2; Value: 8k25; Status: Not Recommended; Tolerance: ±0.1%; Manufacturer Part Number: R0603_8K25_0.1%_0.063W_10PPM; Case: 0603; Mounted: Yes; Sense: No; Socket: No; SMD: Yes; Manufacturer1 Example: TYCO HOLSWORTHY; Manufacturer1 ComponentHeight: 0.5mm; HelpURL: \\cern.ch\dfs\Applications\Altium\Datasheets\R0603_Tyco_RN73.pdf; Author: CERN DEM JLC; CreateDate: 03.12.2007; LatestRevisionDate: 13.03.2008
R400 = R0402_1K_1%_0.0625W_100PPM: Resistor - 1%; Manufacturer: GENERIC; Part Description: General Purpose Thick Film Chip Resistor; Manufacturer1 Part Number: 232270671002L; TC: ±100ppm/°C; PressFit: No; Manufacturer Part Number: R0402_1K_1%_0.0625W_100PPM; Part Number: R0402_1K_1%_0.0625W_100PPM; Tolerance: ±1%; Value: 1k; Component Kind: Standard; Component Type: Standard; Pin Count: 2; Status: Not Recommended; Power: 0.0625W; Case: 0402; Mounted: Yes; Sense: No; Socket: No; SMD: Yes; Manufacturer1 Example: YAGEO PHYCOMP; Manufacturer1 ComponentHeight: 0.4mm; HelpURL: \\cern.ch\dfs\Applications\Altium\Datasheets\R0402_Phycomp_RC0402.pdf; Author: CERN DEM JLC; CreateDate: 03.12.2007; LatestRevisionDate: 17.10.2012
R402 = R0402_270K_1%_0.0625W_100PPM: Resistor - 1%; Manufacturer: GENERIC; Part Description: General Purpose Thick Film Chip Resistor; Manufacturer1 Part Number: 232270672704L; TC: ±100ppm/°C; PressFit: No; Manufacturer Part Number: R0402_270K_1%_0.0625W_100PPM; Part Number: R0402_270K_1%_0.0625W_100PPM; Tolerance: ±1%; Value: 270k; Component Kind: Standard; Component Type: Standard; Pin Count: 2; Status: Not Recommended; Power: 0.0625W; Case: 0402; Mounted: Yes; Sense: No; Socket: No; SMD: Yes; Manufacturer1 Example: YAGEO PHYCOMP; Manufacturer1 ComponentHeight: 0.4mm; HelpURL: \\cern.ch\dfs\Applications\Altium\Datasheets\R0402_Phycomp_RC0402.pdf; Author: CERN DEM JLC; CreateDate: 03.12.2007; LatestRevisionDate: 17.10.2012
R404 R406 R410 = R0402_82K_1%_0.0625W_100PPM: Resistor - 1%; Manufacturer: GENERIC; Part Description: General Purpose Thick Film Chip Resistor; Manufacturer1 Part Number: 232270678203L; TC: ±100ppm/°C; PressFit: No; Manufacturer Part Number: R0402_82K_1%_0.0625W_100PPM; Part Number: R0402_82K_1%_0.0625W_100PPM; Tolerance: ±1%; Value: 82k; Component Kind: Standard; Component Type: Standard; Pin Count: 2; Status: Not Recommended; Power: 0.0625W; Case: 0402; Mounted: Yes; Sense: No; Socket: No; SMD: Yes; Manufacturer1 Example: YAGEO PHYCOMP; Manufacturer1 ComponentHeight: 0.4mm; HelpURL: \\cern.ch\dfs\Applications\Altium\Datasheets\R0402_Phycomp_RC0402.pdf; Author: CERN DEM JLC; CreateDate: 03.12.2007; LatestRevisionDate: 17.10.2012
R405 R408 R411 = R0402_47K_1%_0.0625W_100PPM: Resistor - 1%; Manufacturer: GENERIC; Part Description: General Purpose Thick Film Chip Resistor; Manufacturer1 Part Number: 232270675103L; TC: ±100ppm/°C; PressFit: No; Manufacturer Part Number: R0402_47K_1%_0.0625W_100PPM; Part Number: R0402_47K_1%_0.0625W_100PPM; Tolerance: ±1%; Value: 47k; Component Kind: Standard; Component Type: Standard; Pin Count: 2; Status: Not Recommended; Power: 0.0625W; Case: 0402; Mounted: Yes; Sense: No; Socket: No; SMD: Yes; Manufacturer1 Example: YAGEO PHYCOMP; Manufacturer1 ComponentHeight: 0.4mm; HelpURL: \\cern.ch\dfs\Applications\Altium\Datasheets\R0402_Phycomp_RC0402.pdf; Author: CERN DEM JLC; CreateDate: 03.12.2007; LatestRevisionDate: 17.10.2012
T4 T8 T9 = SI4425DDY-T1-GE3: -30V -19.7A P-Channel MOSFET; Manufacturer: VISHAY SILICONIX; PressFit: No; Bonding: No; Manufacturer Part Number: SI4425DDY-T1-GE3; PackageDescription: SOIC 8, Pitch 1.27mm - Body 4x5mm, IPC Medium Density; Part Description: -30V -19.7A P-Channel MOSFET; Part Number: SI4425DDY-T1-GE3; Component Kind: Standard; Component Type: Standard; Device: SI4425DDY-T1-GE3; Pin Count: 8; Case: SOIC8; Mounted: Yes; Socket: No; SMD: Yes; Sense: No; ComponentHeight: 1.75mm; HelpURL: \\cern.ch\dfs\Applications\Altium\Datasheets\SI4425DDY-T1-GE3.pdf; Author: CERN DEM MR; CreateDate: 05.10.2016; LatestRevisionDate: 05.10.2016
T5 T6 = BSS138LT1G: N-CHANNEL MOSFET WITH DIODE; Manufacturer: ON SEMICONDUCTOR; Part Description: 50V 200mA N-Channel Enhancement Mode Field-Effect Transistor; PressFit: No; Bonding: No; Manufacturer Part Number: BSS138LT1G; PackageDescription: SOT23 3-Leads, Pitch 0.95mm - Body 1.4x3mm, IPC Medium Density; Part Number: BSS138LT1G; Component Kind: Standard; Component Type: Standard; Device: BSS138LT1G; Pin Count: 3; Case: SOT23-3; Mounted: Yes; Socket: No; SMD: Yes; Sense: No; ComponentHeight: 1.11mm; HelpURL: \\cern.ch\dfs\Applications\Altium\Datasheets\BSS138LT1G.pdf; Author: CERN DEM JLC; CreateDate: 23.03.2009; LatestRevisionDate: 23.03.2009
T7 T11 = Si2315BDS-T1-E3: P-CHANNEL MOSFET WITH DIODE; Part Description: -12V -3A P-Channel STripFET® II Power MOSFET; Manufacturer: VISHAY SILICONIX; PressFit: No; Bonding: No; Part Number: Si2315BDS-T1-E3; Component Kind: Standard; Component Type: Standard; Device: Si2315BDS-T1-E3; PackageDescription: SOT, 0.95mm, pitch; 3 pin,1.30mm W X 2.92mm L X 1.12mm H body, IPC Medium Density; Manufacturer Part Number: Si2315BDS-T1-E3; Pin Count: 3; Case: SOT23-3; Mounted: Yes; Socket: No; SMD: Yes; Sense: No; ComponentHeight: 1.12mm; HelpURL: \\cern.ch\dfs\Applications\Altium\Datasheets\Si2315BDS-T1-E3.pdf; Author: CERN DEM JLC; CreateDate: 02.05.2011; LatestRevisionDate: 02.05.2011
T10 T12 = BC857BV: 45V, 100mA PNP General Purpose Double Transistor; Manufacturer: NXP SEMICONDUCTORS; Part Description: -45V -100mA PNP General Purpose Double Transistor; PressFit: No; Bonding: No; Manufacturer Part Number: BC857BV; PackageDescription: SOTFL (SOT666), 0.50mm, Pitch; 6 Pin, 1.20mm W X 1.60mm L X 0.60mm H Body, IPC Medium Density; Part Number: BC857BV; Component Kind: Standard; Component Type: Standard; Device: BC857BV; Pin Count: 6; Case: SOT666; Mounted: Yes; Socket: No; SMD: Yes; Sense: No; ComponentHeight: 0.6mm; HelpURL: \\cern.ch\dfs\Applications\Altium\Datasheets\BC857BV.pdf; Author: CERN DEM JLC; CreateDate: 01.12.2011; LatestRevisionDate: 01.12.2011
TP12 = TP: Testpoint